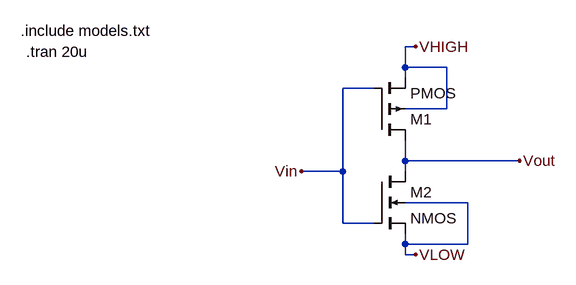
[diagram p0: schematic inverter.asc]
inverter.asc, the LTspice schematic file:
Version 4
SHEET 1 880 680
WIRE 352 -32 336 -32
WIRE 336 0 336 -32
WIRE 400 0 336 0
WIRE 336 16 336 0
WIRE 288 32 240 32
WIRE 400 64 400 0
WIRE 400 64 336 64
WIRE 336 144 336 112
WIRE 512 144 336 144
WIRE 240 160 240 32
WIRE 240 160 176 160
WIRE 336 160 336 144
WIRE 432 208 336 208
WIRE 240 240 240 160
WIRE 288 240 240 240
WIRE 336 272 336 256
WIRE 432 272 432 208
WIRE 432 272 336 272
WIRE 336 288 336 272
WIRE 352 288 336 288
FLAG 352 -32 VHIGH
FLAG 352 288 VLOW
FLAG 176 160 Vin
FLAG 512 144 Vout
SYMBOL pmos4 288 112 M180
SYMATTR InstName M1
SYMATTR Value2 l=50n w=1u
SYMBOL nmos4 288 160 R0
SYMATTR InstName M2
SYMATTR Value2 l=50n w=0.5u
TEXT -256 -56 Left 2 !.include models.txt
TEXT -248 -24 Left 2 !.tran 20u

The netlist it stands for:
* inverter.asc
M1 Vout Vin VHIGH VHIGH PMOS l=50n w=1u
M2 Vout Vin VLOW VLOW NMOS l=50n w=0.5u
.model NMOS NMOS
.model PMOS PMOS
.lib standard.mos
.include models.txt
.tran 20u
.backanno
.end